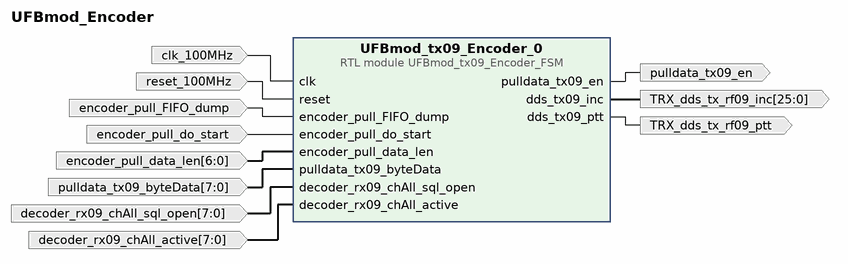
[diagram p0: block diagram of the top level]
# Vivado block design UFBmod_Encoder, xc7a100tfgg484-2, Vivado 2020.1.1
create_bd_design UFBmod_Encoder

create_bd_port -dir I -type clk clk_100MHz
set_property -dict {CONFIG.FREQ_HZ 100000000} [get_bd_ports clk_100MHz]
create_bd_port -dir I -type rst reset_100MHz
set_property -dict {CONFIG.POLARITY ACTIVE_HIGH} [get_bd_ports reset_100MHz]
create_bd_port -dir I encoder_pull_FIFO_dump
create_bd_port -dir I encoder_pull_do_start
create_bd_port -dir I -from 6 -to 0 -type data encoder_pull_data_len
create_bd_port -dir I -from 7 -to 0 -type data pulldata_tx09_byteData
create_bd_port -dir O pulldata_tx09_en
create_bd_port -dir O TRX_dds_tx_rf09_ptt
create_bd_port -dir O -from 25 -to 0 -type data TRX_dds_tx_rf09_inc
create_bd_port -dir I -from 7 -to 0 decoder_rx09_chAll_sql_open
create_bd_port -dir I -from 7 -to 0 decoder_rx09_chAll_active

create_bd_cell -type module -reference UFBmod_tx09_Encoder_FSM UFBmod_tx09_Encoder_0

# ---- connections ----

connect_bd_net [get_bd_ports clk_100MHz] [get_bd_pins UFBmod_tx09_Encoder_0/clk]
connect_bd_net [get_bd_ports reset_100MHz] [get_bd_pins UFBmod_tx09_Encoder_0/reset]
connect_bd_net [get_bd_ports encoder_pull_FIFO_dump] [get_bd_pins UFBmod_tx09_Encoder_0/encoder_pull_FIFO_dump]
connect_bd_net [get_bd_ports encoder_pull_do_start] [get_bd_pins UFBmod_tx09_Encoder_0/encoder_pull_do_start]
connect_bd_net [get_bd_ports encoder_pull_data_len] [get_bd_pins UFBmod_tx09_Encoder_0/encoder_pull_data_len]
connect_bd_net [get_bd_ports pulldata_tx09_byteData] [get_bd_pins UFBmod_tx09_Encoder_0/pulldata_tx09_byteData]
connect_bd_net -net pulldata_tx09_en_0 [get_bd_pins UFBmod_tx09_Encoder_0/pulldata_tx09_en] [get_bd_ports pulldata_tx09_en]
connect_bd_net -net dds_tx09_ptt_0 [get_bd_pins UFBmod_tx09_Encoder_0/dds_tx09_ptt] [get_bd_ports TRX_dds_tx_rf09_ptt]
connect_bd_net -net dds_tx09_inc_0 [get_bd_pins UFBmod_tx09_Encoder_0/dds_tx09_inc] [get_bd_ports TRX_dds_tx_rf09_inc]
connect_bd_net [get_bd_ports decoder_rx09_chAll_sql_open] [get_bd_pins UFBmod_tx09_Encoder_0/decoder_rx09_chAll_sql_open]
connect_bd_net [get_bd_ports decoder_rx09_chAll_active] [get_bd_pins UFBmod_tx09_Encoder_0/decoder_rx09_chAll_active]

validate_bd_design
save_bd_design
